# EasyEDA Pro project PCB.epro

# Board PCB1
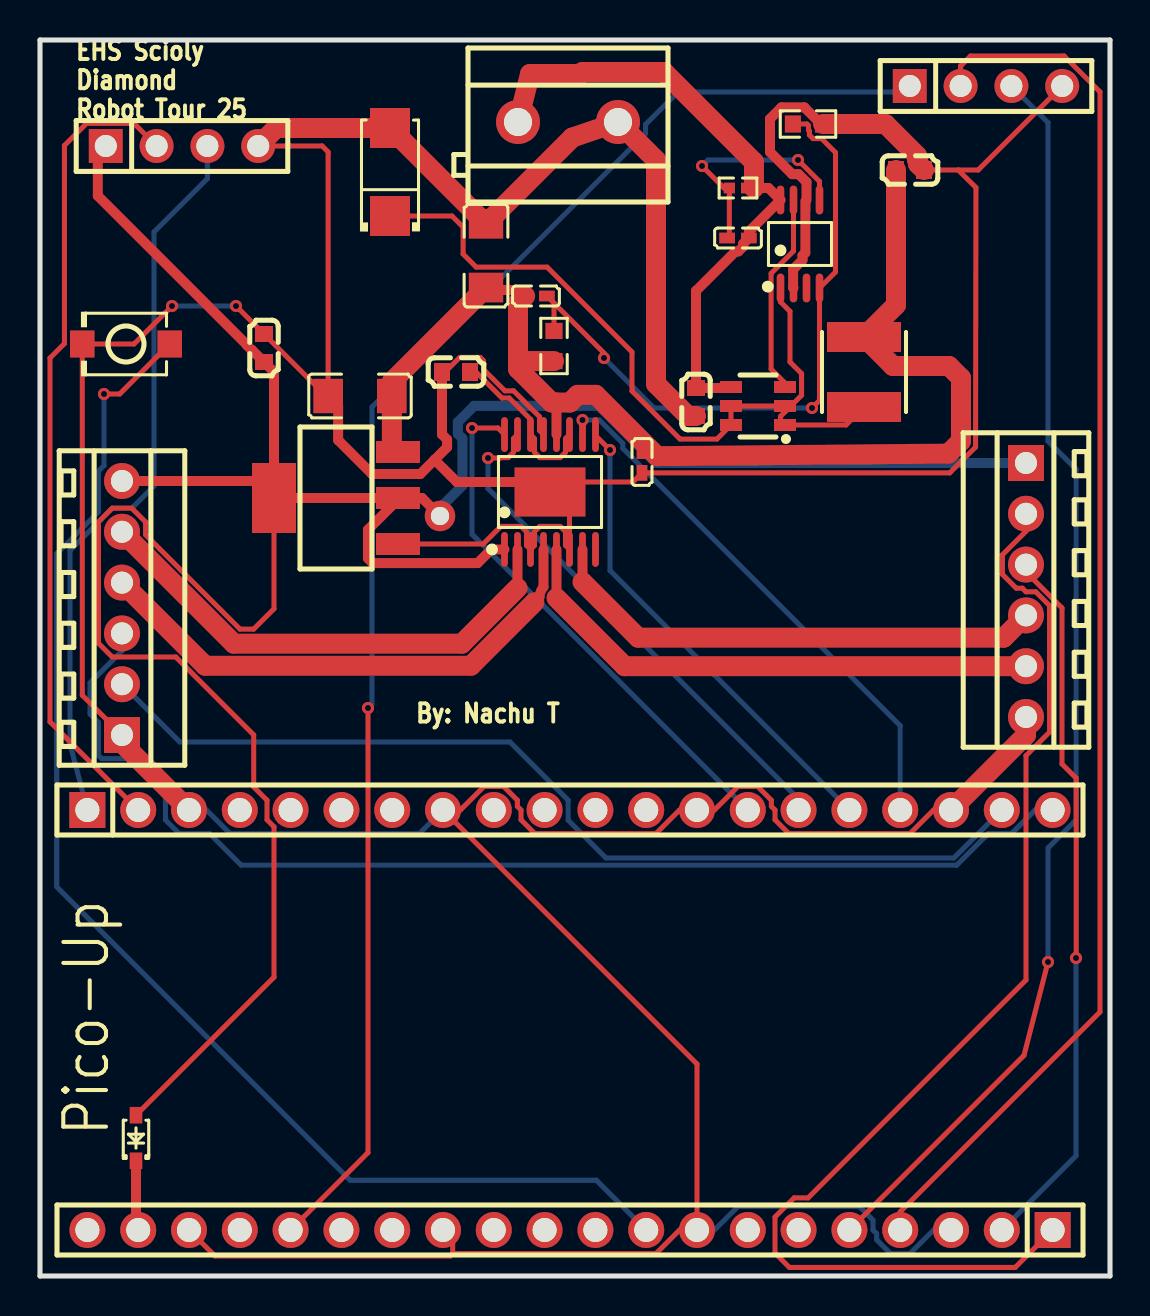
[diagram p0: board, top side]
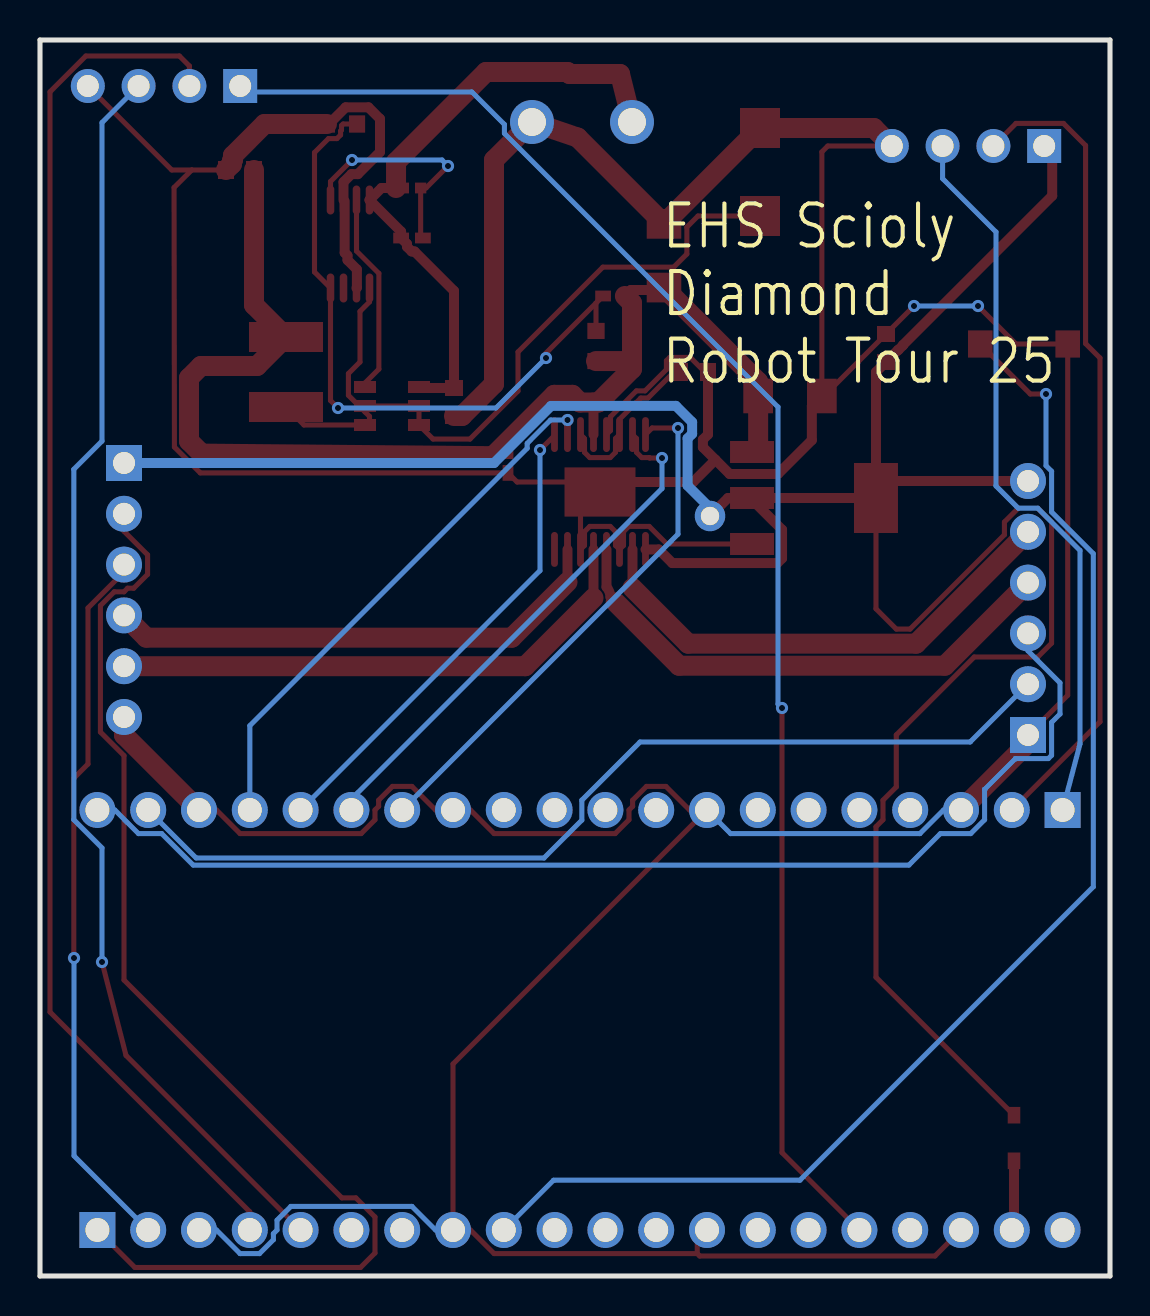
[diagram p1: board, bottom side, seen from below]

Outline 53.5 x 61.8 mm; copper layers: Top Layer, Bottom Layer. Coordinates in mm from the lower left corner of the outline.
Outline path: 0,61.8 0,0 53.5,0 53.5,61.8 0,61.8
Stack: Top Layer 0.035mm / Dielectric1 1.51mm FR4 er 4.5 / Bottom Layer 0.035mm

## Design rules (mm)
template: JLCPCB Capability(Two Layers Board)
spacing copperThickness1oz (default): track to track 0.102, other pairs 0.152 to 0.3
spacing copperThickness2oz: track to track 0.203, other pairs 0.152 to 0.3
track width copperThickness1oz (default): min 0.127, default 0.254, max 2.54
track width copperThickness2oz: min 0.203, default 0.254, max 2.54
differential pair differentialPair (default): width min 0.127, default 0.254, max 2.54; gap min 0.152, default 0.152
via viaSize (default): diameter min 0.5, default 0.61, max 10; hole min 0.3, default 0.305, max 6.3

## Placement (name value [footprint] x y rotation side)
C1  22uF  [C0603]  32.8 43.7 90 top
C4  22uF  [C0603]  43.5 55.3 180 top
C7  22uF  [C0603]  11.2 46.4 270 top
C8  1nF  [C0402]  34.9 51.9 0 top
C9  100pF  [C0402]  24.8 49 180 top
C10  10uF  [C1206]  22.3 51.02 270 top
C11  10uF  [C1206]  16 44 0 top
C12  100nF  [C0402]  30.1 40.7 90 top
C13  2.2uF  [C0603]  20.8 45.2 0 top
D1  SS34  [SMA_L4.3-W2.6-LS5.2-RD]  17.5 55.2 90 top
H1  2.54-1*4P母  [HDR-TH_4P-P2.54-V-F]  7.1 56.5 0 top
H2  2.54-1*4P母  [HDR-TH_4P-P2.54-V-F]  47.3 59.5 0 top
L1  18uH  [IND-SMD_L4.0-W4.0_FNR4012S]  41.2 45.2 90 top
NOREF  -  [Pad_e2166]  20 38 0 top
Q1  FDC5614P  [SOT-23-6_L2.9-W1.6-P0.95-LS2.8-BR]  35.9 43.5 0 top
R3  10kΩ  [R0603]  38.4 57.6 180 top
R4  39.2kΩ  [R0402]  34.9 54.4 0 top
R5  39kΩ  [R0603]  25.7 46.5 270 top
SW1  TS-1088-AR02016  [SW-SMD_L3.9-W3.0-P4.45]  4.3 46.6 180 top
U1  KF301-5.0-2P  [CONN-TH_P5.00_KF301-5.0-2P]  26.4 57.7 180 top
U2  LM3485MMX/NOPB  [VSSOP-8_L3.0-W3.0-P0.65-LS4.9-BL]  38 51.6 0 top
U3  AMS1117-5.0  [SOT-223_L6.7-W3.5-P2.30-BR]  14.8 38.9 0 top
U6  1N5817WS  [SOD-323_L1.7-W1.3-LS2.6-RD-1]  4.8 6.9 90 top
U14  DB125-2.54-6P-GN-S  [CONN-TH_DB125-2.54-6P-GN]  4.1 33.4 90 top
U15  DB125-2.54-6P-GN-S  [CONN-TH_DB125-2.54-6P-GN]  49.3 34.3 270 top
U18  ZX-PM2.54-1-20PY  [HDR-TH_20P-P2.54-V-F]  26.5 2.3 180 top
U19  ZX-PM2.54-1-20PY  [HDR-TH_20P-P2.54-V-F]  26.5 23.3 0 top
U23  DRV8848PWPR  [HTSSOP-16_L5.0-W4.4-P0.65-LS6.4-BL-EP]  25.5 39.2 0 top

## Footprints (pads in the part's own frame, mm; a bottom-side part is the same pattern mirrored in y, then rotated)
C0402
  rect 0.79x0.54 smd: 1(-0.545,0) 2(0.545,0)
C0603
  rect 0.8x0.9 smd: 1(-0.7,0) 2(0.7,0)
C1206
  rect 1.485x1.728 smd: 1(-1.593,0) 2(1.593,0)
CONN-TH_DB125-2.54-6P-GN
  rect 1.8x1.8 hole 1.1: 1(-6.35,0)
  round 1.8 hole 1.1: 2(-3.81,0) 3(-1.27,0) 4(1.27,0) 5(3.81,0) 6(6.35,0)
CONN-TH_P5.00_KF301-5.0-2P
  round 2.2 hole 1.4: 1(-2.5,0) 2(2.5,0)
HDR-TH_4P-P2.54-V-F
  rect 1.7x1.7 hole 1.1: 1(-3.81,0)
  round 1.7 hole 1.1: 2(-1.27,0) 3(1.27,0) 4(3.81,0)
HDR-TH_20P-P2.54-V-F
  rect 1.8x1.8 hole 1.2: 1(-24.13,0)
  round 1.8 hole 1.2: 2(-21.59,0) 3(-19.05,0) 4(-16.51,0) 5(-13.97,0) 6(-11.43,0) 7(-8.89,0) 8(-6.35,0) 9(-3.81,0) 10(-1.27,0) 11(1.27,0) 12(3.81,0) 13(6.35,0) 14(8.89,0) 15(11.43,0) 16(13.97,0) 17(16.51,0) 18(19.05,0) 19(21.59,0) 20(24.13,0)
HTSSOP-16_L5.0-W4.4-P0.65-LS6.4-BL-EP
  oval 0.343x1.746 smd: 1(-2.275,-2.873) 2(-1.625,-2.873) 3(-0.975,-2.873) 4(-0.325,-2.873) 5(0.325,-2.873) 6(0.975,-2.873) 7(1.625,-2.873) 8(2.275,-2.873) 9(2.275,2.873) 10(1.625,2.873) 11(0.975,2.873) 12(0.325,2.873) 13(-0.325,2.873) 14(-0.975,2.873) 15(-1.625,2.873) 16(-2.275,2.873)
  rect 3.55x2.46 smd: 17(0,0)
IND-SMD_L4.0-W4.0_FNR4012S
  rect 1.5x3.7 smd: 1(-1.75,0) 2(1.75,0)
Pad_e2166
  round 1.524 hole 0.914: 1(0,0)
R0402
  rect 0.566x0.54 smd: 1(-0.433,0) 2(0.433,0)
R0603
  rect 0.806x0.864 smd: 1(-0.753,0) 2(0.753,0)
SMA_L4.3-W2.6-LS5.2-RD
  rect 2x2 smd: 1(-2.2,0) 2(2.2,0)
SOD-323_L1.7-W1.3-LS2.6-RD-1
  rect 0.83x0.63 smd: 1(-1.14,0) 2(1.14,0)
SOT-23-6_L2.9-W1.6-P0.95-LS2.8-BR
  rect 1.1x0.6 smd: 1(1.35,-0.95) 2(1.35,0) 3(1.35,0.95) 4(-1.35,0.95) 5(-1.35,0) 6(-1.35,-0.95)
SOT-223_L6.7-W3.5-P2.30-BR
  rect 2.2x1.1 smd: 1(3.099,-2.3) 2(3.099,0) 3(3.099,2.3)
  rect 2.2x3.5 smd: 4(-3.099,0)
SW-SMD_L3.9-W3.0-P4.45
  rect 1.23x1.36 smd: 1(-2.185,0) 2(2.185,0)
VSSOP-8_L3.0-W3.0-P0.65-LS4.9-BL
  oval 0.38x1.45 smd: 1(-0.975,-2.2) 2(-0.325,-2.2) 3(0.325,-2.2) 4(0.975,-2.2) 5(0.975,2.2) 6(0.325,2.2) 7(-0.325,2.2) 8(-0.975,2.2)

## Nets
3V3: H2.1 U18.16
5V: C7.2 H1.1 NOREF.1 U3.2 U3.4 U6.2 U14.6 U15.1 U23.1
6V: C4.2 C9.2 C10.2 C11.2 C12.2 L1.2 R5.2 U3.3 U23.12
GND: C1.1 C4.1 C7.1 C10.1 C11.1 C12.1 C13.1 D1.2 H1.4 H2.4 R3.1 SW1.2 U1.1 U2.2 U2.6 U3.1 U14.1 U15.6 U18.3 U18.8 U18.13 U18.18 U19.3 U19.8 U19.13 U19.18 U23.3 U23.6 U23.13 U23.17
1D1: U14.2 U19.19
1D2: U14.3 U19.20
2D1: U15.2 U18.1
2D2: U15.3 U18.2
AIN1: U19.14 U23.16
AIN2: U19.15 U23.15
AO1: U14.5 U23.2
AO2: U14.4 U23.4
BI: SW1.1 U18.9
BIN1: U19.16 U23.9
BIN2: U19.17 U23.10
BO1: U15.4 U23.7
BO2: U15.5 U23.5
ECHO: H2.3 U18.5
SCL: H1.2 U19.2
SDA: H1.3 U19.1
TRIG: H2.2 U18.4
VREF: C13.2 U23.11 U23.14
$1N633: D1.1 L1.1 Q1.1 Q1.2 Q1.5 Q1.6 U2.1
$1N828: C8.1 R4.1 U2.5
$1N1411: C9.1 R3.2 R5.1 U2.4
$1N2115: C1.2 C8.2 Q1.4 R4.2 U1.2 U2.8
$1N2335: Q1.3 U2.7
$1N3468: U6.1 U18.19

Pads without a net: U2 3; U18 6 7 10 11 12 14 15 17 20; U19 4 5 6 7 9 10 11 12; U23 8

## Via types
v1: diameter 0.61, hole 0.305, Top Layer to Bottom Layer, 14 vias

## Routing (per net, layer and track width the routed paths; a pad name or vN(x,y) marks a point on that pad's centre or on a via; arc(x,y) is an arc through that point)
3V3: length 76.6
  Top Layer w0.254: U18.16 16.4,6.17 v1(16.4,28.4)
  Bottom Layer w0.254: H2.1 43.19,59.2 31.9,59.2 30.28,57.58 30.28,57.13 16.6,43.45 16.6,28.6 v1(16.4,28.4)
5V: length 140
  Top Layer w0.254: U6.2 11.7,14.94 11.7,22.46 11.35,22.81 11.35,23.79 10.69,24.45 10.69,27.05 6.79,30.95 3.61,30.95 2.92,31.64 2.92,37.7 3.61,38.39 4.59,38.39 5.28,37.7 5.28,37.06 10,32.34 10.69,32.34 11.7,33.36 11.7,38.9
  Top Layer w0.5: U3.2 17.9,38.82 16.4,37.32 16.4,35.88 16.63,35.65 21.88,35.65 22.56,36.33 23.22,36.33 ; U3.2 19.1,38.9 NOREF.1 ; U3.2 11.7,38.9 ; U14.6 10.85,39.75 11.7,38.9 ; 11.7,38.9 11.7,45.2 C7.2 10.6,46.3 10.58,46.3 10.35,46.53 10.35,46.55 2.89,54.01 2.89,56.1 H1.1
  Bottom Layer w0.5: U15.1 30.8,40.65 27.94,43.51 21.71,43.51 20.89,42.69 20.89,42.11 21.12,41.88 21.12,39.52 20,38.4 NOREF.1
6V: length 62.1
  Top Layer w0.5: C9.2 23.96,49.3 22.19,49.3 ; 25.82,43.67 25.82,42.07
  Top Layer w1: 23.9,45.71 23.9,48.64 C9.2 ; 23.9,45.71 23.94,45.75 R5.2 ; 23.9,45.71 23.9,45.35 25.58,43.67 26.5,43.67 26.88,44.06 27.78,44.06 30.85,40.99 45.42,41.12 46.05,41.75 46.05,44.9 45.45,45.5 42.65,45.5 L1.2 42.8,48.55 C4.2 ; U3.3 17.59,41.51 C11.2 17.59,44.72 C10.2
GND: length 319.3
  Top Layer w0.254: U19.18 44.68,23.3 43.5,22.12 37.44,22.12 36.75,22.81 36.75,23.3 36.57,23.48 36.57,23.79 35.88,24.48 34.9,24.48 33.72,23.3 U19.13 31.98,23.3 30.8,22.12 24.74,22.12 24.05,22.81 24.05,23.3 23.87,23.48 23.87,23.79 23.18,24.48 22.2,24.48 21.02,23.3 U19.8 32.85,10.6 U18.8 31.98,2.3 30.8,1.12 20.64,1.12 ; v1(6.6,48.5) 4.7,46.6 SW1.2 2.11,29.03 U14.1 ; 25,39.7 29.65,39.7 C12.1 45.49,40.16 46.78,41.45 46.8,54.42 45.91,55.3 ; v1(9.8,48.5) C7.1 14.3,44 C11.1 14.41,56.2 14.11,56.5 H1.4 ; 20.64,1.12 20.52,1 8.75,1 U18.18 ; 20.64,1.12 20.64,1.81 U18.13 ; 45.91,55.3 C4.1 ; 45.91,55.3 46.91,55.3 H2.4 ; C13.1 20.26,45.2 20.98,45.93 22.02,45.93 22.18,45.77 22.18,45.32 23.25,44.26 23.68,44.26 24.98,42.96 24.98,42.27 25.18,42.07 ; U3.1 22.16,36.6 23.04,37.48 24.06,37.48 24.33,37.22 24.33,36.53 24.53,36.33 24.72,36.53 24.72,37.22 24.99,37.48 26.01,37.48 26.28,37.22 26.28,36.53 26.47,36.33 26.47,38.22 26,38.7
  Top Layer w0.5: 25,39.7 20.84,39.7 19.73,40.81 ; U2.6 38.32,54.7 37.93,55.09 37.61,55.09 36.5,56.2 36.5,57.86 37.08,58.43 38.22,58.43 39.05,57.6 ; 19.73,40.81 19.02,40.1 16.6,40.1 14.91,41.79 14.91,43.5 C11.1 ; 19.73,40.81 20.35,41.44 20.35,41.82 20.1,42.08 C13.1 ; U2.2 37.66,49.42 37.66,50.33 38.12,50.8 38.12,51.02 38.27,51.16 38.27,53.74
  Top Layer w1: R3.1 42.27,57.6 43.85,56.02 43.85,55.81 43.9,55.76 43.9,55.6 C4.1 ; U14.1 4.1,26.65 U19.3 ; H1.4 11.81,57.4 D1.2 ; C1.1 32.4,43 30.8,44.6 30.8,55.8 U1.1 26.62,56.92 C10.1 17.51,57.4 ; U15.6 49.3,27.05 U19.18
  Bottom Layer w0.254: v1(6.6,48.5) v1(9.8,48.5) ; U18.3 44.68,2.3 43.5,1.12 42.52,1.12 41.83,1.81 41.83,2.12 41.65,2.3 41.65,2.79 40.96,3.48 34.9,3.48 33.72,2.3 U18.8 ; U19.3 8.32,23.3 9.5,22.12 18.97,22.12 U19.8
1D1: length 49.2
  Bottom Layer w0.254: U14.2 6.99,26.7 23.5,26.7 26.41,23.79 26.41,22.79 28.3,20.9 45.69,20.9 U19.19
1D2: length 58.9
  Bottom Layer w0.254: U14.3 4.1,31.26 2.5,29.66 2.5,28.1 2.92,27.68 2.92,26.03 3.08,25.87 4.73,25.87 6.27,24.33 6.27,22.81 6.96,22.12 8.48,22.12 10.06,20.54 45.84,20.54 47.41,22.12 48.58,22.12 49.76,23.3 U19.20
2D1: length 59.9
  Top Layer w0.254: U15.2 49.3,37.24 48.12,36.06 48.12,35.08 48.81,34.39 49.12,34.39 49.3,34.21 49.79,34.21 50.48,33.52 50.48,27.2 49.3,26.02 49.3,14.8 38.41,3.91 37.71,3.91 36.75,2.95 36.75,1.15 37.47,0.43 48.76,0.43 U18.1
2D2: length 35.8
  Top Layer w0.254: U15.3 49.3,35.2 51.1,33.4 51.1,25.6 51.81,24.89 51.81,15.91 v1(51.8,15.9)
  Bottom Layer w0.254: U18.2 51.8,6.01 v1(51.8,15.9)
AIN1: length 26.6
  Top Layer w0.254: v1(21.6,42.4) 22.9,42.4 23.22,42.07
  Bottom Layer w0.254: U19.14 21.6,37.09 v1(21.6,42.4)
AIN2: length 26.4
  Top Layer w0.254: v1(22.4,40.9) 23.02,40.9 23.04,40.92 23.41,40.92 23.68,41.19 23.68,41.87 23.88,42.07
  Bottom Layer w0.254: U19.15 37.63,23.6 37.63,24.14 22.4,39.37 v1(22.4,40.9)
AO1: length 25.2
  Top Layer w0.5: 23.88,36.33 23.88,34.4
  Top Layer w1: 23.88,34.4 21.09,31.62 9.69,31.62 U14.5
AO2: length 26.4
  Top Layer w0.5: 24.72,33.68 24.97,33.94 arc(25.03,34.21) 25.18,34.45 25.18,36.33
  Top Layer w1: U14.4 8.26,30.51 21.55,30.51 24.72,33.68
BI: length 66.5
  Top Layer w0.254: SW1.1 3.98,44.1 v1(3.2,44.1)
  Bottom Layer w0.254: U18.9 27.82,4.79 15.5,4.79 0.83,19.46 0.83,36.12 2.92,38.2 2.92,40.24 3.2,40.52 v1(3.2,44.1)
BIN1: length 24
  Top Layer w0.254: 27.78,42.07 27.78,42.03 v1(28.5,41.3)
  Bottom Layer w0.254: U19.16 28.5,35.27 v1(28.5,41.3)
BIN2: length 27.3
  Top Layer w0.254: 27.12,42.07 v1(27.12,42.8)
  Bottom Layer w0.254: U19.17 43.01,27.52 29.14,41.39 29.14,41.63 27.97,42.8 v1(27.12,42.8)
BO1: length 25.4
  Top Layer w0.5: 27.12,36.33 27.12,34.7
  Top Layer w1: U15.4 48.19,31.92 29.91,31.92 27.12,34.7
BO2: length 27.3
  Top Layer w0.5: 25.82,36.33 25.82,33.9
  Top Layer w1: 25.82,33.9 29.24,30.49 U15.5
ECHO: length 62.9
  Top Layer w0.254: v1(50.4,15.7) 49.2,11.03 U18.5
  Bottom Layer w0.254: v1(50.4,15.7) 50.4,21.4 51.81,22.81 51.81,40.34 50.4,41.74 50.4,57.67 H2.3
SCL: length 40.9
  Top Layer w0.254: H1.2 4.7,57.63 2.32,57.63 1.22,56.53 1.22,46.62 0.5,45.9 0.5,27.71 U19.2
SDA: length 36.7
  Bottom Layer w0.254: H1.3 8.37,54.87 5.7,52.2 5.7,39.5 4.59,38.39 3.61,38.39 1.5,36.28 1.5,26.6 U19.1
TRIG: length 70
  Top Layer w0.254: H2.2 46.03,60.5 46.53,61 51.21,61 53,59.21 53,13.2 43.01,3.21 U18.4
VREF: length 8.6
  Top Layer w0.254: 21.5,45.5 23.1,43.9 23.46,43.9 24.53,42.83 24.53,42.07 24.72,41.87 24.72,41.19 24.99,40.92 26.01,40.92 26.28,41.19 26.28,41.85 26.3,41.88 26.3,41.9 26.47,42.07
$1N633: length 40
  Top Layer w0.254: U2.1 37.03,48.71 37.5,48.23 37.5,45.7 38.08,45.12 38.08,44.03 37.25,43.21 ; D1.1 20.6,53 21.16,52.44 21.16,51.1 21.81,50.44 25.36,50.44 29.6,46.2 29.6,44.25 32,41.85 33.85,41.85 Q1.6 Q1.5 Q1.2 37.25,43.21 ; 37.25,43.21 37.03,42.98 37.03,42.78 Q1.1 40.3,42.55 L1.1
$1N828: length 11.7
  Top Layer w0.254: C8.1 34.47,52.01 R4.1 34.2,54.4 v1(33.1,55.5) ; U2.5 38.97,54.72 v1(37.9,55.8)
  Bottom Layer w0.254: v1(33.1,55.5) 33.4,55.8 v1(37.9,55.8)
$1N1411: length 33.3
  Top Layer w0.254: R5.1 25.7,48.64 ; 25.7,48.64 C9.1 ; 25.7,48.64 28.2,46.14 v1(28.2,45.9) ; v1(38.6,43.4) 38.97,43.78 U2.4 39.78,50.2 39.78,56.17 39.08,56.87 38.65,56.87 38.47,57.05 38.47,57.25 38.42,57.3 38.42,57.52 38.35,57.6 R3.2
  Bottom Layer w0.254: v1(28.2,45.9) 30.7,43.4 v1(38.6,43.4)
$1N2115: length 31.8
  Top Layer w0.5: R4.2 36.43,54.4 U2.8 35.44,52.22 C8.2 35.15,51.61 35.15,51.46 34.92,51.23 34.77,51.23 32.8,49.25 C1.2 34.5,44.4 Q1.4
  Top Layer w1: 35.7,54.4 35.7,55.7 31.2,60.2 27.12,60.2 27.02,60.1 24.5,60.1 U1.2
$1N2335: length 10.1
  Top Layer w0.254: U2.7 37.68,51.25 36.56,50.13 36.56,45.34 37.25,44.65 Q1.3
$1N3468: length 3.5
  Top Layer w0.5: U6.1 4.8,2.41 U18.19

## Text on the board
Bottom Silkscreen Layer: EHS Scioly / Diamond / Robot Tour 25
Top Silkscreen Layer: EHS Scioly / Diamond / Robot Tour 25 | By: Nachu T | Pico-Up
